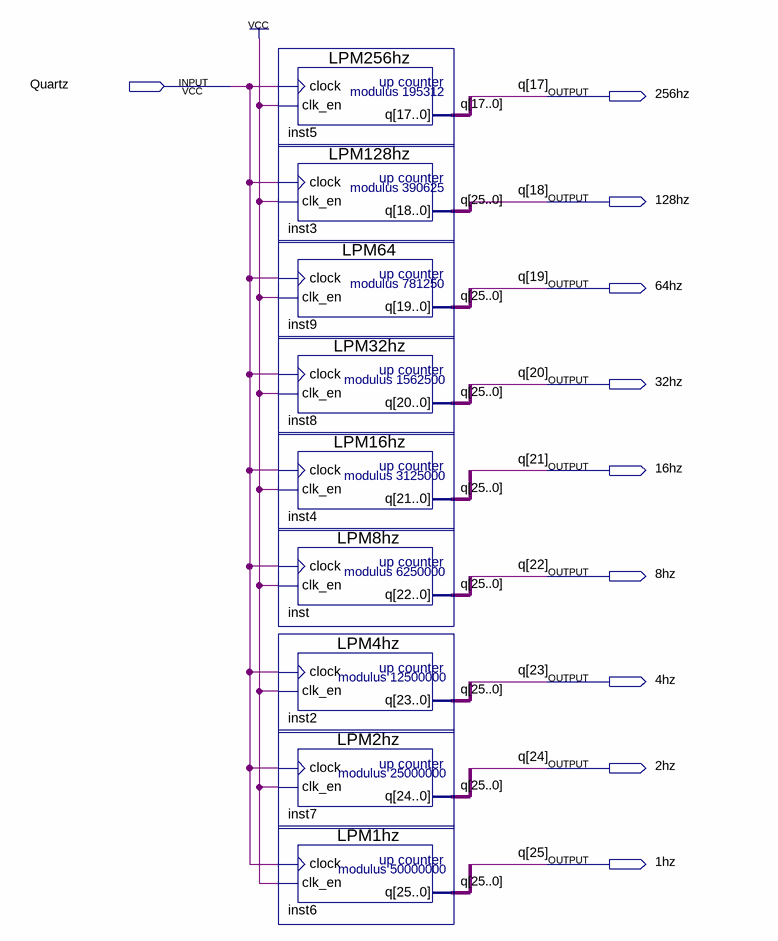
[diagram p0: schematic sheet]
// Quartus schematic MultiFrequency.bdf as structural Verilog: 9 symbols, 10 pins
module MultiFrequency (
  input  Quartz,
  output \256hz ,
  output \128hz ,
  output \64hz ,
  output \32hz ,
  output \16hz ,
  output \8hz ,
  output \4hz ,
  output \2hz ,
  output \1hz 
);

  wire [16:0] q;

  LPM256hz inst5 (.clock(Quartz), .clk_en(1'b1), .q({\256hz , q}));
  LPM128hz inst3 (
    .clock(Quartz), .clk_en(1'b1),
    .q({\1hz , \2hz , \4hz , \8hz , \16hz , \32hz , \64hz , \128hz , \256hz , q}));
  LPM64 inst9 (
    .clock(Quartz), .clk_en(1'b1),
    .q({\1hz , \2hz , \4hz , \8hz , \16hz , \32hz , \64hz , \128hz , \256hz , q}));
  LPM32hz inst8 (
    .clock(Quartz), .clk_en(1'b1),
    .q({\1hz , \2hz , \4hz , \8hz , \16hz , \32hz , \64hz , \128hz , \256hz , q}));
  LPM16hz inst4 (
    .clock(Quartz), .clk_en(1'b1),
    .q({\1hz , \2hz , \4hz , \8hz , \16hz , \32hz , \64hz , \128hz , \256hz , q}));
  LPM8hz inst (
    .clock(Quartz), .clk_en(1'b1),
    .q({\1hz , \2hz , \4hz , \8hz , \16hz , \32hz , \64hz , \128hz , \256hz , q}));
  LPM4hz inst2 (
    .clock(Quartz), .clk_en(1'b1),
    .q({\1hz , \2hz , \4hz , \8hz , \16hz , \32hz , \64hz , \128hz , \256hz , q}));
  LPM2hz inst7 (
    .clock(Quartz), .clk_en(1'b1),
    .q({\1hz , \2hz , \4hz , \8hz , \16hz , \32hz , \64hz , \128hz , \256hz , q}));
  LPM1hz inst6 (
    .clock(Quartz), .clk_en(1'b1),
    .q({\1hz , \2hz , \4hz , \8hz , \16hz , \32hz , \64hz , \128hz , \256hz , q}));

  // Other names for the same wires on the sheet: q[25:17] = {\1hz , \2hz , \4hz , \8hz , \16hz , \32hz , \64hz , \128hz , \256hz }
endmodule
